# EAGLE design untitled (EAGLE 5.12)
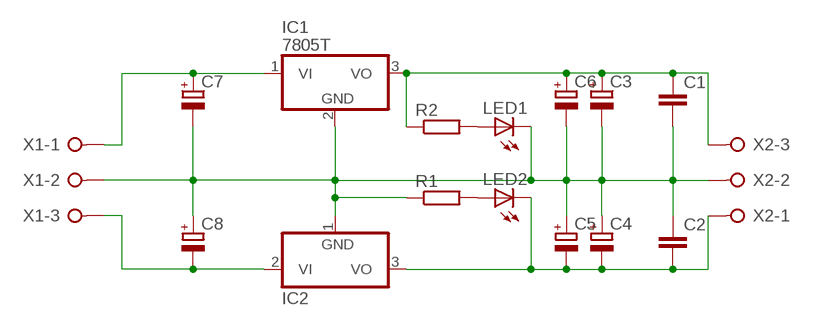
[diagram p0: schematic, sheet 1]

## Parts
C1  C-EU050-025X075  [C050-025X075]
C2  C-EU050-025X075  [C050-025X075]
C3  CPOL-EUE2,5-6E  [E2,5-6E]
C4  CPOL-EUE2,5-6E  [E2,5-6E]
C5  CPOL-EUE2,5-6E  [E2,5-6E]
C6  CPOL-EUE2,5-6E  [E2,5-6E]
C7  CPOL-EUE2,5-6E  [E2,5-6E]
C8  CPOL-EUE2,5-6E  [E2,5-6E]
IC1  7805T  [TO220H]
IC2  7905T  [TO220H]
LED1  LED5MM  [LED5MM]
LED2  LED5MM  [LED5MM]
R1  R-EU_0204/7  [0204/7]
R2  R-EU_0204/7  [0204/7]
X1  W237-3E  [W237-3E]
X2  W237-3E  [W237-3E]

## Nets
N$1: LED2.A R1.2
N$2: LED1.A R2.2
N$3: C1.2 C2.1 C3.- C4.+ C5.+ C6.- C7.- C8.+ IC1.2(GND) IC2.1(GND) LED1.K(C) R1.1 X1.2 X2.2
N$4: C7.+ IC1.1(VI) X1.1
N$5: C8.- IC2.2(VI) X1.3
N$6: C2.2 C4.- C5.- IC2.3(VO) LED2.K(C) X2.1
N$7: C1.1 C3.+ C6.+ IC1.3(VO) R2.1 X2.3

## Library data of the parts
C1 C2 = resistor:C-EU: CAPACITOR, European symbol
C3-C8 = resistor:CPOL-EU: POLARIZED CAPACITOR, European symbol
IC1 = linear:78*: Positive VOLTAGE REGULATOR Source: http://cache.national.com/ds/LM/LM78L05.pdf http://www.fairchildsemi.com/ds/LM/LM7805.pdf
IC2 = linear:79*: Negative VOLTAGE REGULATOR
LED1 LED2 = led:LED: LED OSRAM: - CHIPLED LG R971, LG N971, LY N971, LG Q971, LY Q971, LO R971, LY R971 LH N974, LH R974 LS Q976, LO Q976, LY Q976 LO Q996 - Hyper CHIPLED LW Q18S LB Q993, LB Q99A, LB R99A - SideLED LS A670, LO A670, LY A670, LG A670, LP A670 LB A673, LV A673, LT A673, LW A673 LH A674 LY A675 LS A676, LA A676, LO A676, LY A676, LW A676 LS A679, LY A679, LG A679 - Hyper Micro SIDELED® LS Y876, LA Y876, LO Y876, LY Y876 LT Y87S - SmartLED LW L88C, LW L88S LB L89C, LB L89S, LG L890 LS L89K, LO L89K, LY L89K LS L896, LA L896, LO L896, LY L896 - TOPLED LS T670, LO T670, LY T670, LG T670, LP T670 LSG T670, LSP T670, LSY T670, LOP T670, LYG T670 LG T671, LOG T671, LSG T671 LB T673, LV T673, LT T673, LW T673 LH T674 LS T676, LA T676, LO T676, LY T676, LB T676, LH T676, LSB T676, LW T676 LB T67C, LV T67C, LT T67C, LS T67K, LO T67K, LY T67K, LW E67C LS E67B, LA E67B, LO E67B, LY E67B, LB E67C, LV E67C, LT E67C LW T67C LS T679, LY T679, LG T679 LS T770, LO T770, LY T770, LG T770, LP T770 LB T773, LV T773, LT T773, LW T773 LH T774 LS E675, LA E675, LY E675, LS T675 LS T776, LA T776, LO T776, LY T776, LB T776 LHGB T686 LT T68C, LB T68C - Hyper Mini TOPLED® LB M676 - Mini TOPLED Santana® LG M470 LS M47K, LO M47K, LY M47K Source: http://www.osram.convergy.de LUXEON: - LUMILED® LXK2-PW12-R00, LXK2-PW12-S00, LXK2-PW14-U00, LXK2-PW14-V00 LXK2-PM12-R00, LXK2-PM12-S00, LXK2-PM14-U00 LXK2-PE12-Q00, LXK2-PE12-R00, LXK2-PE12-S00, LXK2-PE14-T00, LXK2-PE14-U00 LXK2-PB12-K00, LXK2-PB12-L00, LXK2-PB12-M00, LXK2-PB14-N00, LXK2-PB14-P00, LXK2-PB14-Q00 LXK2-PR12-L00, LXK2-PR12-M00, LXK2-PR14-Q00, LXK2-PR14-R00 LXK2-PD12-Q00, LXK2-PD12-R00, LXK2-PD12-S00 LXK2-PH12-R00, LXK2-PH12-S00 LXK2-PL12-P00, LXK2-PL12-Q00, LXK2-PL12-R00 Source: www.luxeon.com KINGBRIGHT: KA-3528ASYC Source: www.kingbright.com
R1 R2 = resistor:R-EU_: RESISTOR, European symbol
X1 X2 = con-wago-508:W237-3E: WAGO SREW CLAMP; OC_FARNELL: unknown; OC_NEWARK: unknown

## Board
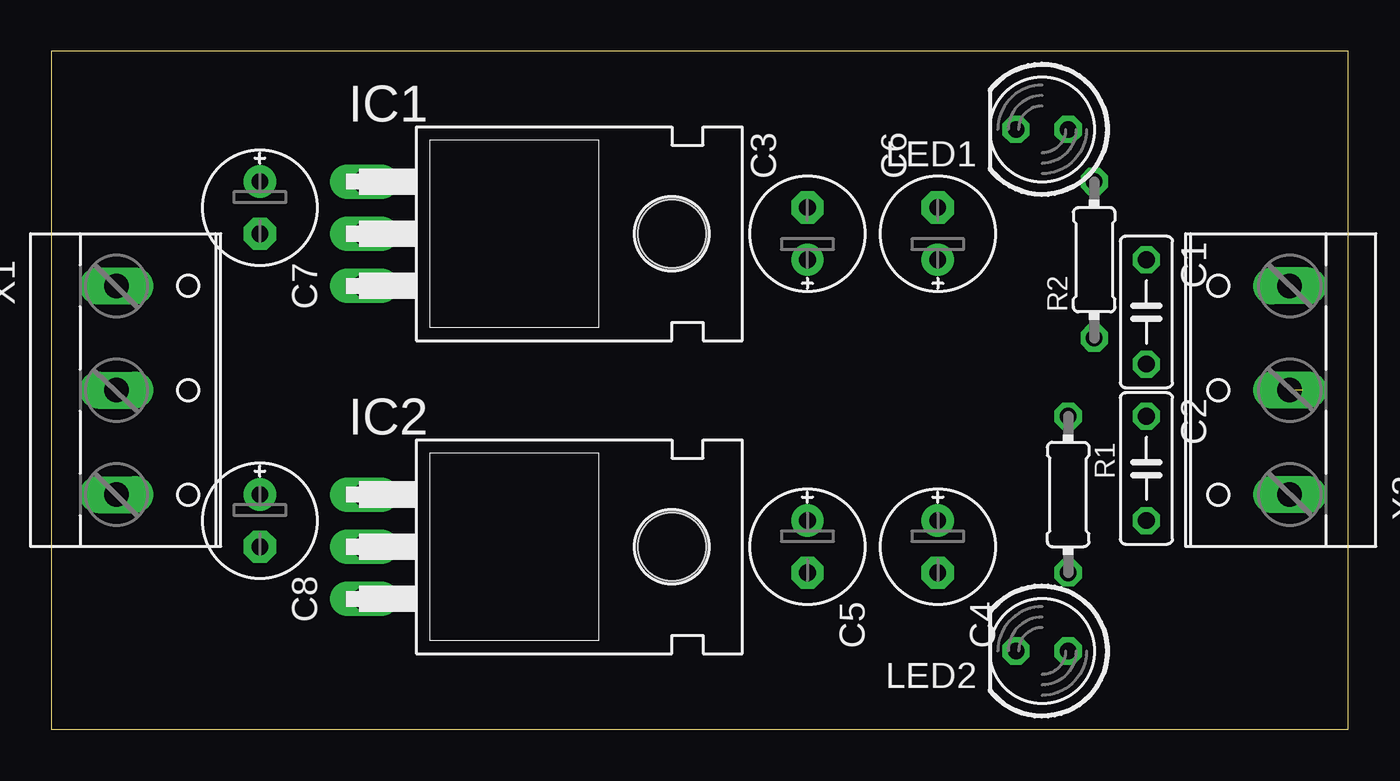
[diagram p1: board, top side]
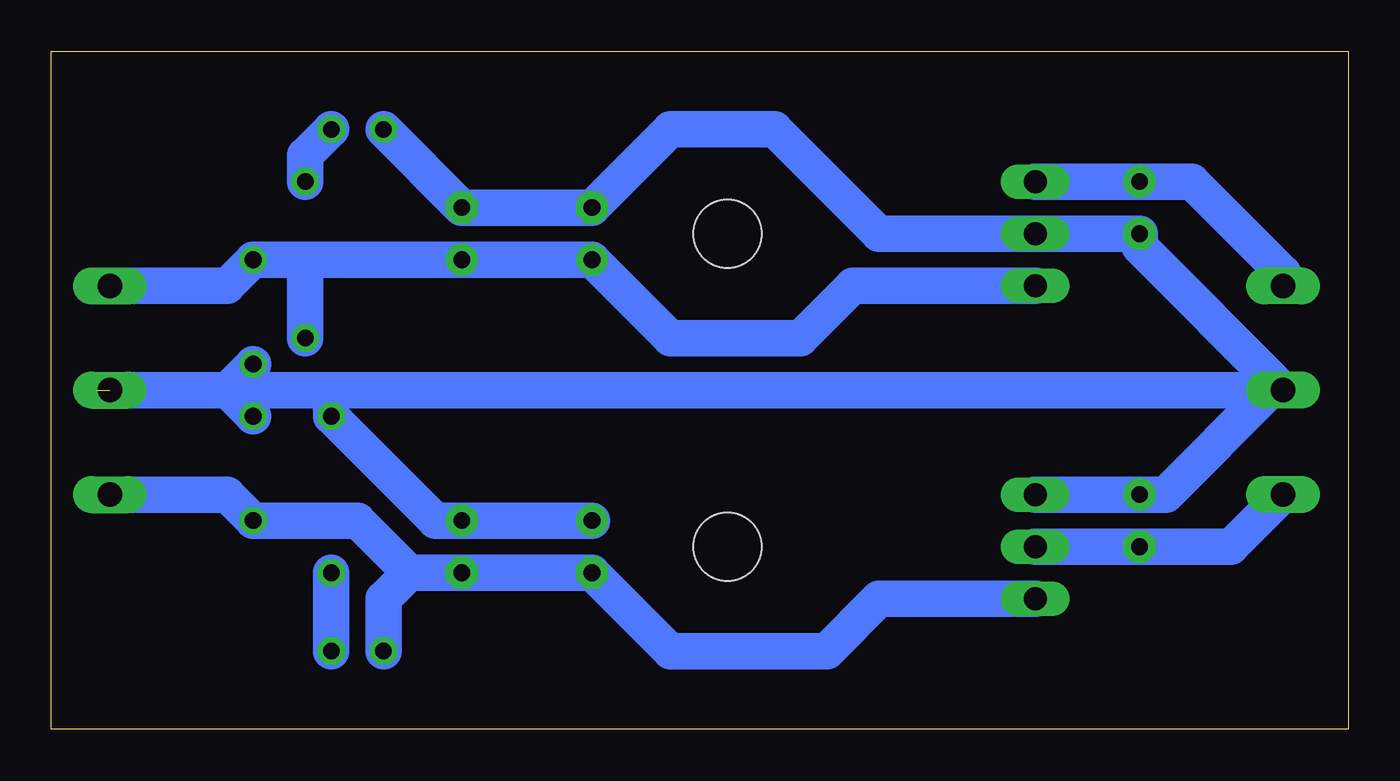
[diagram p2: board, bottom side, seen from below]

Size 63.17 x 33.01 mm. Coordinates in mm from the lower left corner, seen from the top.
Outline: 0,0 63.17,0 63.17,33.01 0,33.01 0,0
Copper layers (1*16): Top 0.035mm / dielectric 1.5mm / Bottom 0.035mm
Design rules "default": minimum track width 10mil, minimum drill 24mil, track to track 8mil, track to pad 8mil, pad to pad 8mil, via to via 8mil, smd to smd 8mil, copper to edge 40mil, drill to drill 8mil, minimum pad ring 10mil, minimum via ring 8mil, stop-mask expansion 4mil, vias tented up to drill 0mil, thermal gap 10mil

### Footprints (pad centres in the part's own frame; a part is rotated, then mirrored left to right if it is on the bottom)
C050-025X075 = drill 0.813 octagon: 1 -2.54,0; 2 2.54,0
E2,5-6E = drill 0.813 pad 1.575 round: + -1.27,0 | drill 0.813 pad 1.575 octagon: - 1.27,0
TO220H = drill 1.118 long: 1 -2.54,-10.16; 2 0,-10.16; 3 2.54,-10.16 | hole 3.302: 0,4.826
LED5MM = drill 0.813 octagon: A -1.27,0; K 1.27,0
0204/7 = drill 0.813 octagon: 1 -3.81,0; 2 3.81,0
W237-3E = drill 1.194 long: 1 -5.08,-0.635; 2 0,-0.635; 3 5.08,-0.635

### Placement (x,y rotation side)
C1  53.34,20.32 270 top
C2  53.34,12.7 270 top
C3  36.83,24.13 90 top
C4  43.18,8.89 270 top
C5  36.83,8.89 270 top
C6  43.18,24.13 90 top
C7  10.16,25.4 270 top
C8  10.16,10.16 270 top
IC1  25.4,24.13 270 top
IC2  25.4,8.89 270 top
LED1  48.26,29.21 180 top
LED2  48.26,3.81 180 top
R1  49.53,11.43 270 top
R2  50.8,22.86 90 top
X1  3.81,16.51 270 top
X2  59.69,16.51 90 top

### Tracks (layer width: path | path; a pad name or v marks a point on that pad's centre or on a via)
N$1
  Bottom 1.778: R1.2 LED2.A
N$2
  Bottom 1.778: R2.2 50.8,27.94 LED1.A
N$3  (1 unrouted)
  Bottom 1.778: 3.81,16.51 X1.2 10.16,23.5 C7.- IC1.2 22.86,24.13 27.94,29.21 33.02,29.21 C3.- C6.- LED1.K | 3.81,16.51 49.53,16.51 | 49.53,16.51 54.61,16.51 | 54.61,16.51 60.96,16.51 | 54.61,16.51 C1.2 | 54.61,16.51 C2.1 | 49.53,16.51 R1.1 44.45,10.16 C4.+ C5.+ | IC2.1 C8.+ 8.89,11.43 3.81,16.51
N$4
  Bottom 1.778: X1.1 3.17,22.23 7.62,26.67 C7.+ IC1.1
N$5
  Bottom 1.778: IC2.2 C8.- 5.71,8.89 X1.3
N$6
  Bottom 1.778: X2.1 54.61,11.43 C2.2 48.26,10.16 45.72,7.62 | 45.72,7.62 C4.- C5.- 33.02,3.81 25.4,3.81 22.86,6.35 IC2.3 | LED2.K 46.99,6.35 45.72,7.62
N$7
  Bottom 1.778: 50.8,22.86 C6.+ C3.+ 33.02,19.05 26.67,19.05 24.13,21.59 IC1.3 | 50.8,22.86 C1.1 54.61,21.59 X2.3 | 50.8,22.86 R2.1